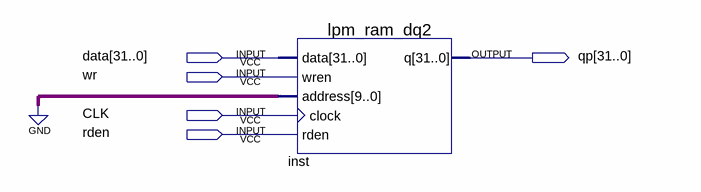
[diagram p0: schematic sheet]
// Quartus schematic testram.bdf as structural Verilog: 1 symbols, 5 pins
module testram (
  input  [31:0] data,
  input  wr,
  input  CLK,
  input  rden,
  output [31:0] qp
);

  lpm_ram_dq2 inst (.data(data), .wren(wr), .address({10{1'b0}}), .clock(CLK), .rden(rden), .q(qp));
endmodule
